# Altium schematic sheet Sheet03.SchDoc
size A4
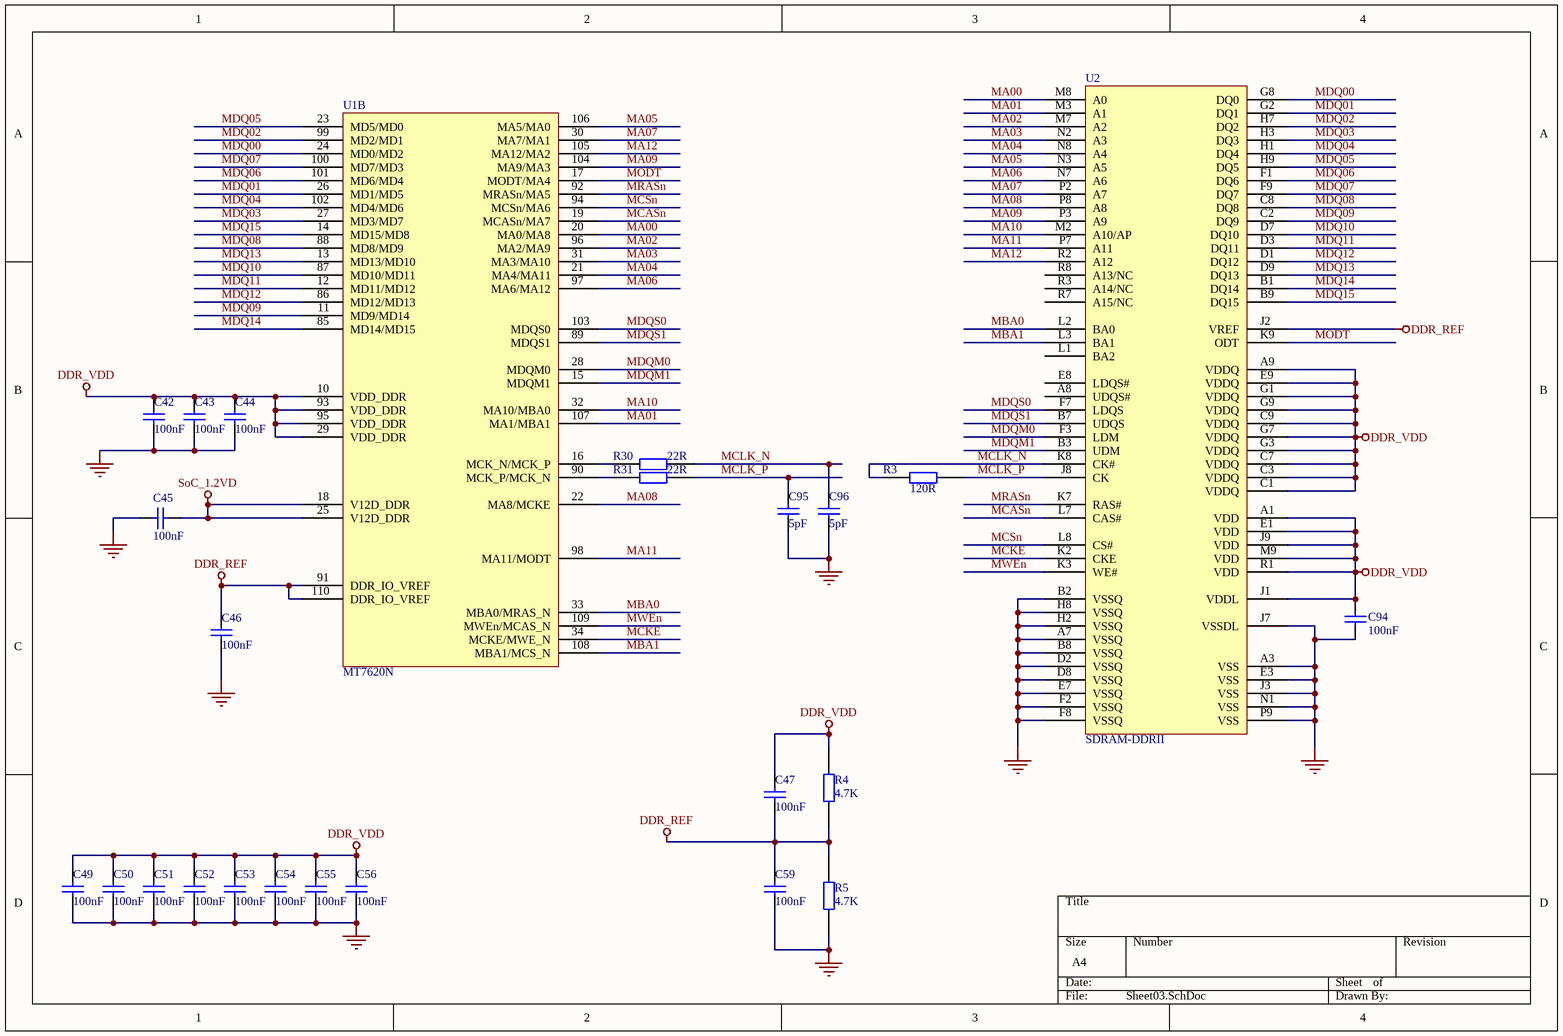
[diagram p0: Sheet03.SchDoc]

## Parts
C42  100nF  [R0402]
C43  100nF  [R0402]
C44  100nF  [R0402]
C45  100nF  [R0402]
C46  100nF  [R0402]
C47  100nF  [R0402]
C49  100nF  [R0402]
C50  100nF  [R0402]
C51  100nF  [R0402]
C52  100nF  [R0402]
C53  100nF  [R0402]
C54  100nF  [R0402]
C55  100nF  [R0402]
C56  100nF  [R0402]
C59  100nF  [R0402]
C94  100nF  [R0402]
C95  5pF  [R0402]
C96  5pF  [R0402]
R3  120R  [R0402]
R4  4.7K  [R0402]
R5  4.7K  [R0402]
R30  22R  [R0402]
R31  22R  [R0402]
U1  MT7620N  [QFN-148-RT]  (part B of 5)
U2  SDRAM-DDRII  [FPBGA-84N]

## Nets
DDR_REF: C46.2 C47.1 C59.2 R4.1 R5.2 U1.91(DDR_IO_VREF) U1.110(DDR_IO_VREF) U2.J2(VREF)
DDR_VDD: C42.2 C43.2 C44.2 C47.2 C49.2 C50.2 C51.2 C52.2 C53.2 C54.2 C55.2 C56.2 C94.1 R4.2 U1.10(VDD_DDR) U1.29(VDD_DDR) U1.93(VDD_DDR) U1.95(VDD_DDR) U2.A1(VDD) U2.A9(VDDQ) U2.C1(VDDQ) U2.C3(VDDQ) U2.C7(VDDQ) U2.C9(VDDQ) U2.E1(VDD) U2.E9(VDDQ) U2.G1(VDDQ) U2.G3(VDDQ) U2.G7(VDDQ) U2.G9(VDDQ) U2.J1(VDDL) U2.J9(VDD) U2.M9(VDD) U2.R1(VDD)
GND: C42.1 C43.1 C44.1 C45.2 C46.1 C49.1 C50.1 C51.1 C52.1 C53.1 C54.1 C55.1 C56.1 C59.1 C94.2 C95.1 C96.1 R5.1 U2.A3(VSS) U2.A7(VSSQ) U2.B2(VSSQ) U2.B8(VSSQ) U2.D2(VSSQ) U2.D8(VSSQ) U2.E3(VSS) U2.E7(VSSQ) U2.F2(VSSQ) U2.F8(VSSQ) U2.H2(VSSQ) U2.H8(VSSQ) U2.J3(VSS) U2.J7(VSSDL) U2.N1(VSS) U2.P9(VSS)
SoC_1.2VD: C45.1 U1.18(V12D_DDR) U1.25(V12D_DDR)
MA00: U1.20(MA0/MA8) U2.M8(A0)
MA01: U1.107(MA1/MBA1) U2.M3(A1)
MA02: U1.96(MA2/MA9) U2.M7(A2)
MA03: U1.31(MA3/MA10) U2.N2(A3)
MA04: U1.21(MA4/MA11) U2.N8(A4)
MA05: U1.106(MA5/MA0) U2.N3(A5)
MA06: U1.97(MA6/MA12) U2.N7(A6)
MA07: U1.30(MA7/MA1) U2.P2(A7)
MA08: U1.22(MA8/MCKE) U2.P8(A8)
MA09: U1.104(MA9/MA3) U2.P3(A9)
MA10: U1.32(MA10/MBA0) U2.M2(A10/AP)
MA11: U1.98(MA11/MODT) U2.P7(A11)
MA12: U1.105(MA12/MA2) U2.R2(A12)
MBA0: U1.33(MBA0/MRAS_N) U2.L2(BA0)
MBA1: U1.108(MBA1/MCS_N) U2.L3(BA1)
MCASn: U1.19(MCASn/MA7) U2.L7(CAS#)
MCKE: U1.34(MCKE/MWE_N) U2.K2(CKE)
MCLK_N: C96.2 R3.2 R30.1 U2.K8(CK#)
MCLK_P: C95.2 R3.1 R31.1 U2.J8(CK)
MCSn: U1.94(MCSn/MA6) U2.L8(CS#)
MDQ00: U1.24(MD0/MD2) U2.G8(DQ0)
MDQ01: U1.26(MD1/MD5) U2.G2(DQ1)
MDQ02: U1.99(MD2/MD1) U2.H7(DQ2)
MDQ03: U1.27(MD3/MD7) U2.H3(DQ3)
MDQ04: U1.102(MD4/MD6) U2.H1(DQ4)
MDQ05: U1.23(MD5/MD0) U2.H9(DQ5)
MDQ06: U1.101(MD6/MD4) U2.F1(DQ6)
MDQ07: U1.100(MD7/MD3) U2.F9(DQ7)
MDQ08: U1.88(MD8/MD9) U2.C8(DQ8)
MDQ09: U1.11(MD9/MD14) U2.C2(DQ9)
MDQ10: U1.87(MD10/MD11) U2.D7(DQ10)
MDQ11: U1.12(MD11/MD12) U2.D3(DQ11)
MDQ12: U1.86(MD12/MD13) U2.D1(DQ12)
MDQ13: U1.13(MD13/MD10) U2.D9(DQ13)
MDQ14: U1.85(MD14/MD15) U2.B1(DQ14)
MDQ15: U1.14(MD15/MD8) U2.B9(DQ15)
MDQM0: U1.28(MDQM0) U2.F3(LDM)
MDQM1: U1.15(MDQM1) U2.B3(UDM)
MDQS0: U1.103(MDQS0) U2.F7(LDQS)
MDQS1: U1.89(MDQS1) U2.B7(UDQS)
MODT: U1.17(MODT/MA4) U2.K9(ODT)
MRASn: U1.92(MRASn/MA5) U2.K7(RAS#)
MWEn: U1.109(MWEn/MCAS_N) U2.K3(WE#)
NetR30_2: R30.2 U1.16(MCK_N/MCK_P)
NetR31_2: R31.2 U1.90(MCK_P/MCK_N)

Not connected (* = marked no-connect by the designer): U2 A8(UDQS#) E8(LDQS#) L1(BA2) R3(A14/NC) R7(A15/NC) R8(A13/NC)

## Library data of the parts
C42-C47 C49-C56 C59 C94-C96 = Cap Semi: 2pF, 50V, +/-0.25pF; Manufacturer: Generic Components; Class: Passive; SubClass: Capacitor; Value: 0.1uF; Published: 08/06/2000; Publisher: Altium Hobart Technology Centre
R3-R5 R30 R31 = RES
U2 = SDRAM-DDRII: H5PS1G63, H5PS518, NT5TU32M16DG